# Altium schematic sheet PCB-LabRoc.SchDoc
size A4
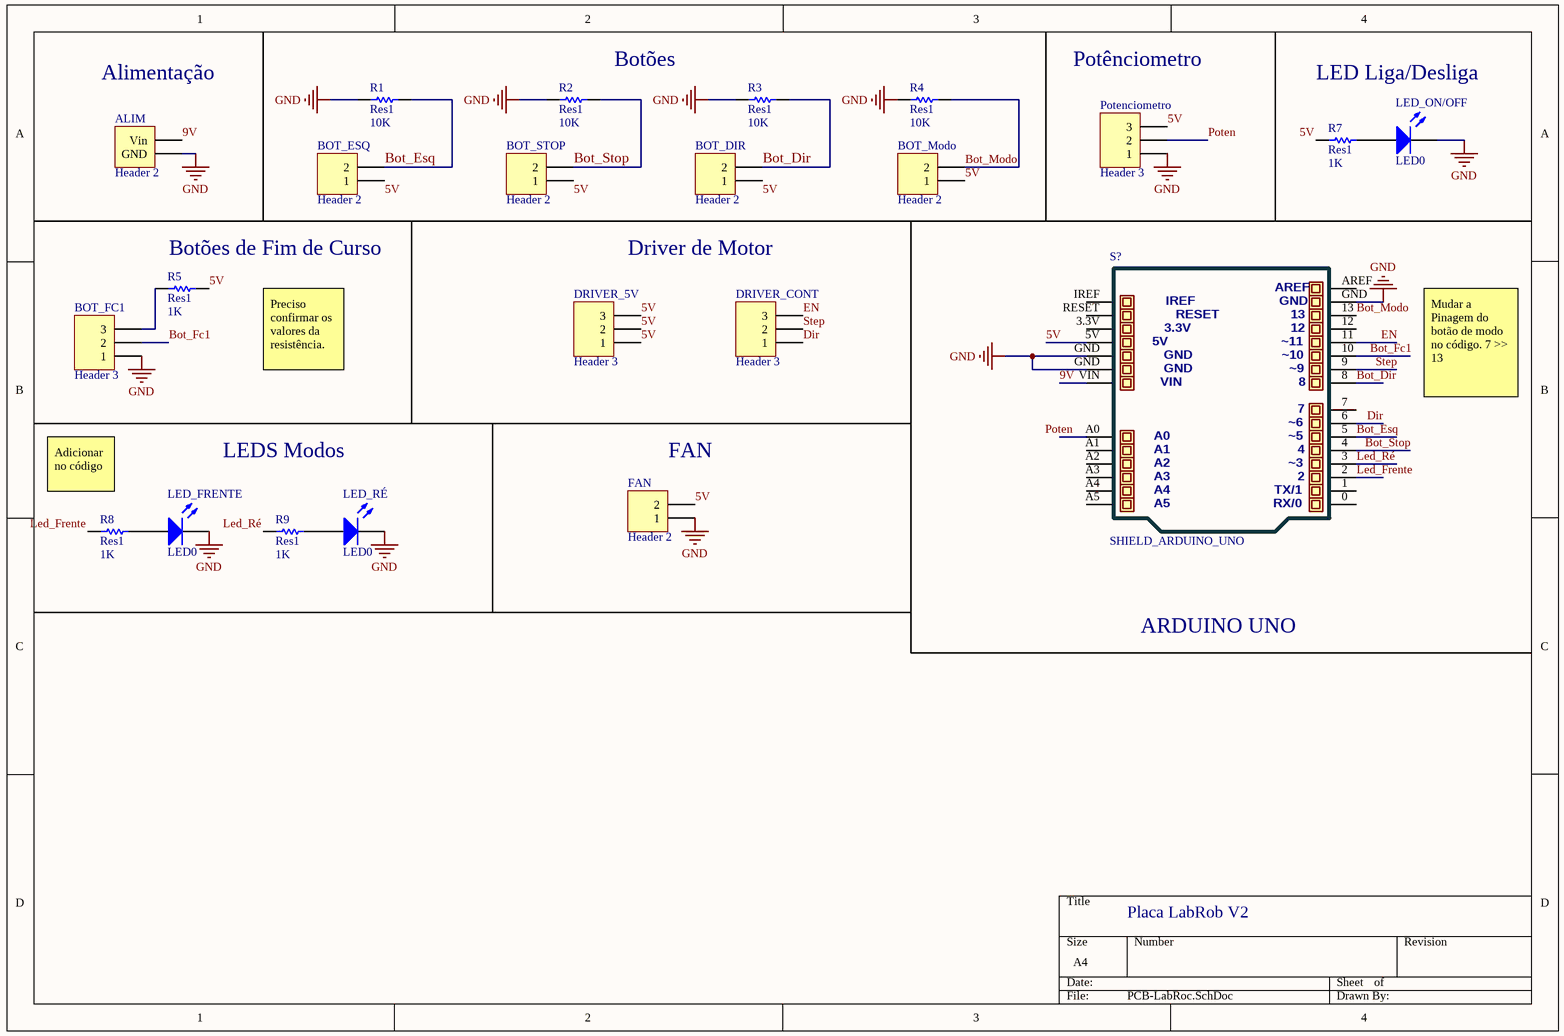
[diagram p0: PCB-LabRoc.SchDoc]

## Parts
ALIM  Header 2  [HDR1X2]
BOT_DIR  Header 2  [HDR1X2]
BOT_ESQ  Header 2  [HDR1X2]
BOT_FC1  Header 3  [HDR1X3]
BOT_Modo  Header 2  [HDR1X2]
BOT_STOP  Header 2  [HDR1X2]
DRIVER_5V  Header 3  [HDR1X3]
DRIVER_CONT  Header 3  [HDR1X3]
FAN  Header 2  [HDR1X2]
LED_FRENTE  LED0  [LED-0]
LED_ON/OFF  LED0  [LED-0]
LED_RÉ  LED0  [LED-0]
Potenciometro  Header 3  [HDR1X3]
R1  Res1  value 10K  [AXIAL-0.3]
R2  Res1  value 10K  [AXIAL-0.3]
R3  Res1  value 10K  [AXIAL-0.3]
R4  Res1  value 10K  [AXIAL-0.3]
R5  Res1  value 1K  [AXIAL-0.3]
R7  Res1  value 1K  [AXIAL-0.3]
R8  Res1  value 1K  [AXIAL-0.3]
R9  Res1  value 1K  [AXIAL-0.3]
S?  SHIELD_ARDUINO_UNO  [SHIELD_ARDUINO]

## Nets
GND: ALIM.1(GND) BOT_FC1.1 FAN.1 LED_FRENTE.2(K) LED_ON/OFF.2(K) LED_RÉ.2(K) Potenciometro.1 R1.1 R2.1 R3.1 R4.2 S?.GND
5V: BOT_DIR.1 BOT_ESQ.1 BOT_Modo.1 BOT_STOP.1 DRIVER_5V.1 DRIVER_5V.2 DRIVER_5V.3 FAN.2 Potenciometro.3 R5.2 R7.1 S?.5V
9V: ALIM.2(Vin) S?.VIN
Bot_Dir: BOT_DIR.2 R3.2 S?.8
Bot_Esq: BOT_ESQ.2 R1.2 S?.5
Bot_Fc1: BOT_FC1.2 S?.10
Bot_Modo: BOT_Modo.2 R4.1 S?.13
Bot_Stop: BOT_STOP.2 R2.2 S?.4
Dir: DRIVER_CONT.1 S?.6
EN: DRIVER_CONT.3 S?.11
Led_Frente: R8.1 S?.2
Led_Ré: R9.1 S?.3
Poten: Potenciometro.2 S?.A0
Step: DRIVER_CONT.2 S?.9
NetBOT_FC1_3: BOT_FC1.3 R5.1
NetLED_FRENTE_1: LED_FRENTE.1(A) R8.2
NetLED_ON/OFF_1: LED_ON/OFF.1(A) R7.2
NetLED_RÉ_1: LED_RÉ.1(A) R9.2

Not connected (* = marked no-connect by the designer): S? 0 1 3.3V 7 12 A1 A2 A3 A4 A5 AREF IREF RESET

## Notes on the sheet
- Alimentação
- (near R2) Botões
- Potênciometro
- LED Liga/Desliga
- (near R5) Botões de Fim de Curso
- Driver de Motor
- Preciso confirmar os valores da resistência.
- Mudar a Pinagem do botão de modo no código. 7 >> 13
- (near R8) Adicionar no código
- LEDS Modos
- (near FAN) FAN
- ARDUINO UNO
- Placa LabRob V2
- (in symbol SHIELD_ARDUINO_UNO) ~11; ~10; ~9; ~6; ~5; ~3; TX/1; RX/0

## Library data of the parts
ALIM BOT_DIR BOT_ESQ BOT_Modo BOT_STOP FAN = Header 2: Header, 2-Pin; LatestRevisionDate: 17-Jul-2002; LatestRevisionNote: Re-released for DXP Platform.; Publisher: Altium Limited
BOT_FC1 DRIVER_5V DRIVER_CONT Potenciometro = Header 3: Header, 3-Pin; LatestRevisionDate: 17-Jul-2002; LatestRevisionNote: Re-released for DXP Platform.; Publisher: Altium Limited
LED_FRENTE LED_ON/OFF LED_RÉ = LED0: Typical INFRARED GaAs LED; Published: 8-Jun-2000; LatestRevisionDate: 08-Jul-2005; LatestRevisionNote: Mech Layer 1 removed.; PackageReference: LED-0; Publisher: Altium Limited; PackageDescription: LED; 2 Leads
R1-R5 R7-R9 = Res1: Resistor; Published: 8-Jun-2000; LatestRevisionDate: 17-Jul-2002; LatestRevisionNote: Re-released for DXP Platform.; PackageReference: AXIAL-0.3; Publisher: Altium Limited; PackageDescription: Axial Device, Thru-Hole; 2 Leads; 0.3 in Pin Spacing